# EasyEDA Pro project FromADActiveMarkerDeck.eprj

# Board ActiveMarkerDeck
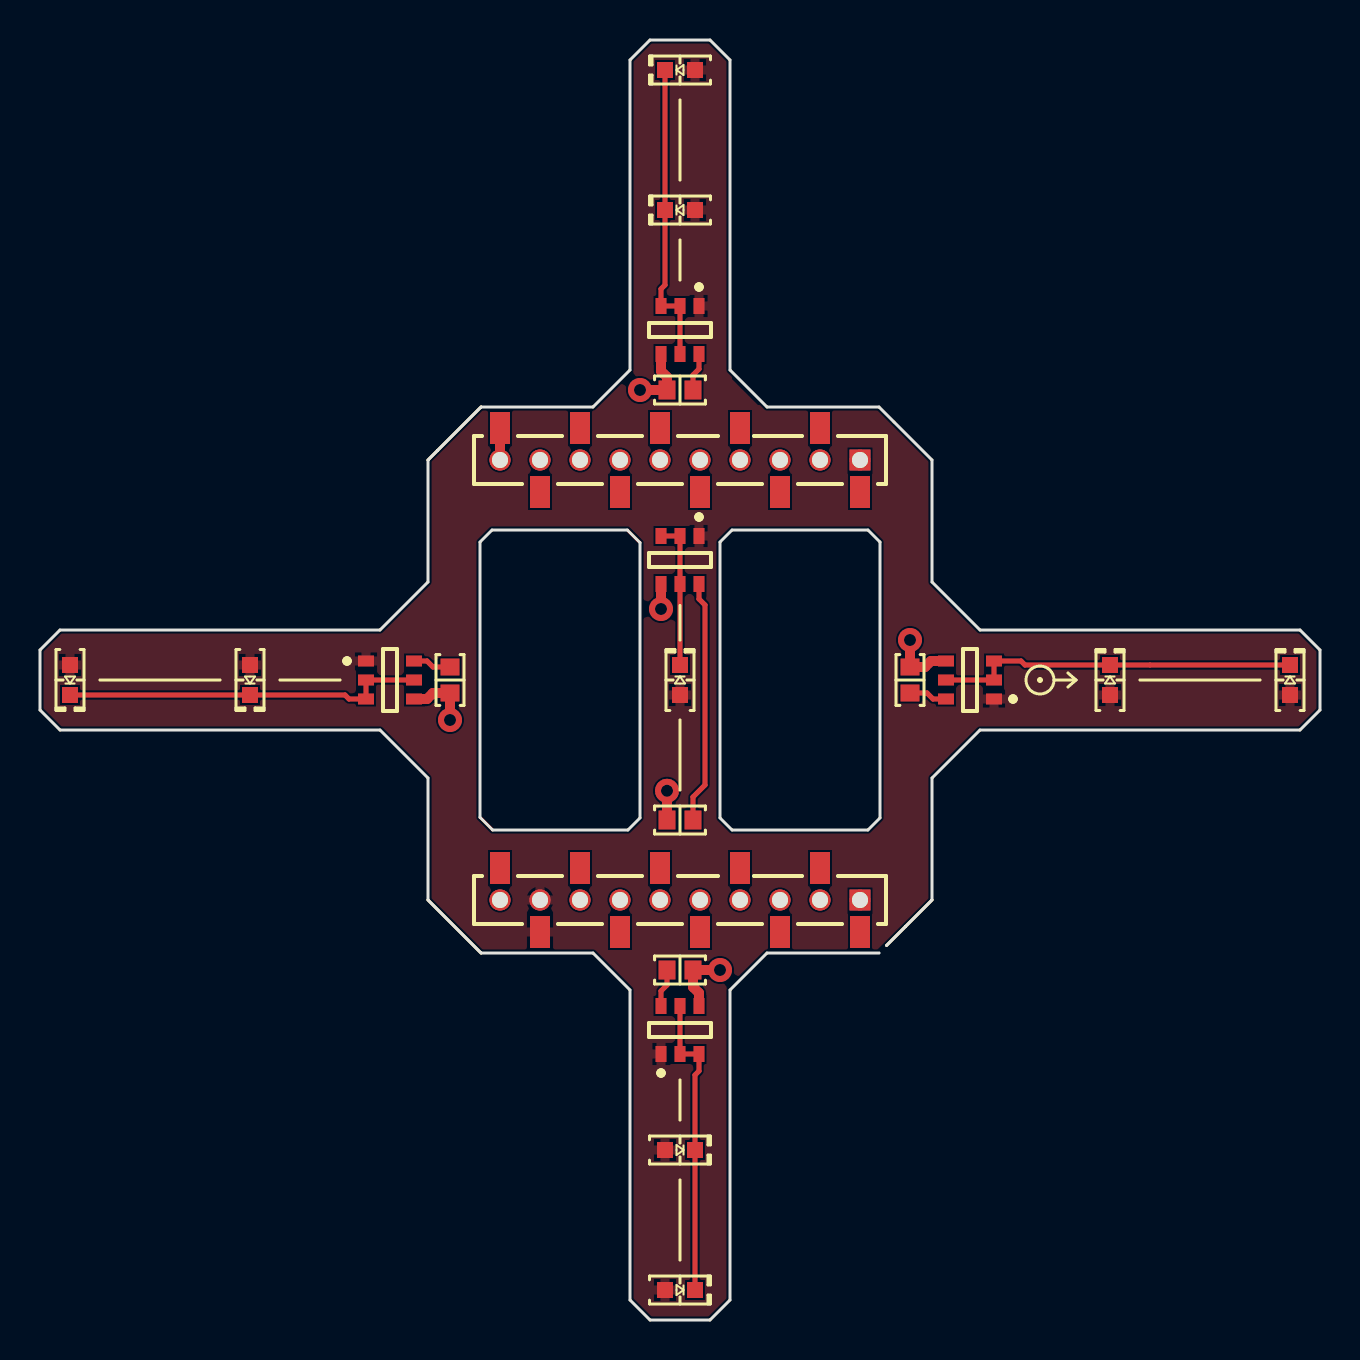
[diagram p0: board, top side]
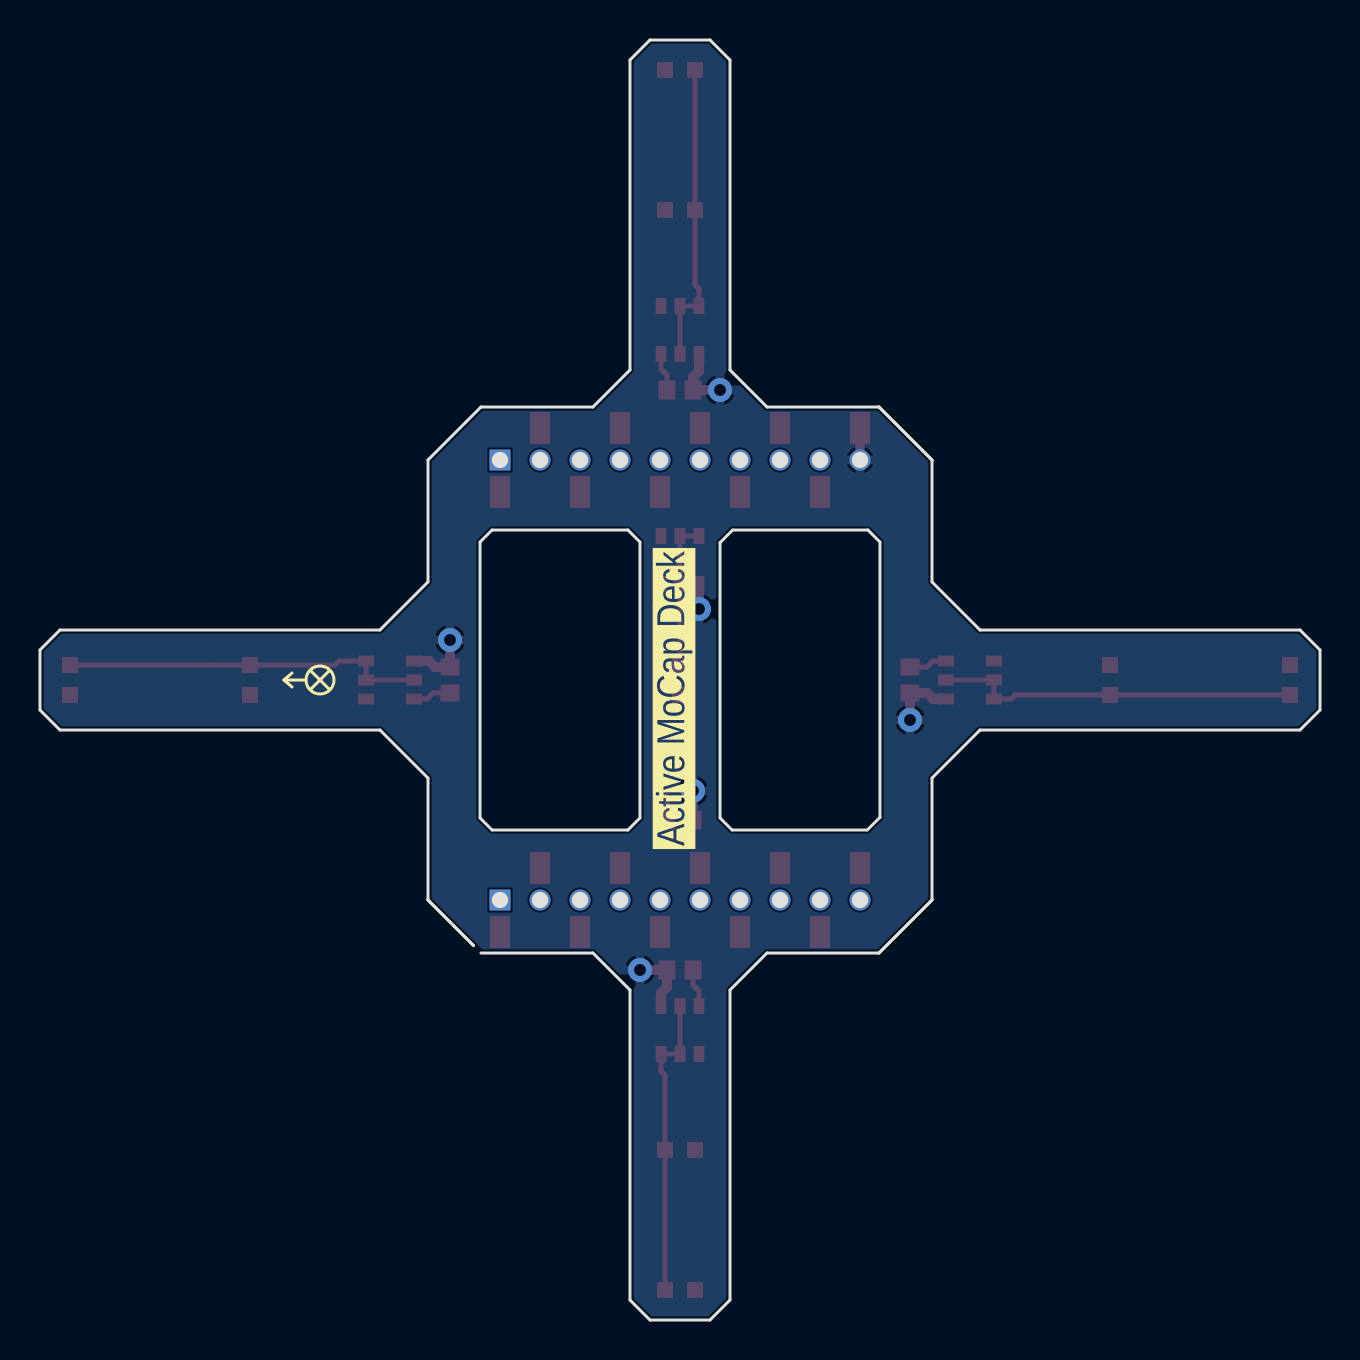
[diagram p1: board, bottom side, seen from below]

Outline 64 x 64 mm; copper layers: Top Layer, Bottom Layer. Coordinates in mm from the lower left corner of the outline.
Outline path: 19.4,43 22.05,45.65 ; 19.4,43 22.05,45.65 ; 19.4,43 19.4,36.9 17,34.5 1,34.5 0,33.5 0,30.5 1,29.5 17,29.5 19.4,27.1 19.4,21 ; 19.4,21 22.05,18.35 ; 19.4,21 22.05,18.35 ; 22.05,45.65 27.65,45.65 29.5,47.5 29.5,63 30.5,64 33.5,64 34.5,63 34.5,47.5 36.35,45.65 41.95,45.65 44.6,43 44.6,36.9 47,34.5 63,34.5 64,33.5 64,30.5 63,29.5 47,29.5 44.6,27.1 44.6,21 ; 22.05,18.35 27.65,18.35 29.5,16.5 29.5,1 30.5,0 33.5,0 34.5,1 34.5,16.5 36.35,18.35 41.95,18.35 ; 44.6,21 42.32,18.72 44.6,21 ; 22,38.9 22.6,39.5 29.37,39.5 30,38.87 30,25.1 29.4,24.5 22.63,24.5 22,25.13 22,38.9 ; 34,38.9 34,25.1 34.6,24.5 41.4,24.5 42,25.1 42,38.9 41.4,39.5 34.6,39.5 34,38.9
Stack: Top Layer 0.0356mm / Dielectric 1 0.32mm FR-4 er 4.8 / Bottom Layer 0.0356mm

## Design rules (mm)
spacing Clearance (default): track to track 0.2, other pairs 0.2 to 0.2
spacing Clearence 0.1524_NetClass: track to track 0.2, other pairs 0.2 to 0.2
track width Width (default): min 0.254, default 0.254, max 0.5
differential pair DiffPairsRouting (default): width min 0.381, default 0.381, max 0.381; gap min 0.254, default 0.254
via RoutingVias (default): diameter min 1.2, default 1.2, max 1.2; hole min 0.6, default 0.6, max 0.6

## Placement (name value [footprint] x y rotation side)
D1  850nm  [LED 0603_1608 RED]  32 32 90 top
D2  850nm  [LED 0603_1608 RED]  32 62.5 180 top
D3  850nm  [LED 0603_1608 RED]  62.5 32 90 top
D4  850nm  [LED 0603_1608 RED]  32 1.5 0 top
D5  850nm  [LED 0603_1608 RED]  1.5 32 270 top
D6  850nm  [LED 0603_1608 RED]  32 55.5 180 top
D7  850nm  [LED 0603_1608 RED]  53.5 32 90 top
D8  850nm  [LED 0603_1608 RED]  32 8.5 0 top
D9  850nm  [LED 0603_1608 RED]  10.5 32 270 top
EXP_ORIENTATION  VAL**  [EXP_ORIENTATION]  50 32 0 top
P1  CF_EXP_LEFT  [BF090-10-X-B2]  32 43 180 top
P2  CF_EXP_RIGHT  [BF090-10-X-B2]  32 21 180 top
R1  20 Ohms  [RES 0603_1608]  32 25 180 top
R2  20 Ohms  [RES 0603_1608]  32 46.5 180 top
R3  20 Ohms  [RES 0603_1608]  43.5 32 90 top
R4  20 Ohms  [RES 0603_1608]  32 17.5 0 top
R5  20 Ohms  [RES 0603_1608]  20.5 32 270 top
U1  BCR421UW6Q-7  [FP-SOT26_SC74R-MFG]  32 38 270 top
U2  BCR421UW6Q-7  [FP-SOT26_SC74R-MFG]  32 49.5 270 top
U3  BCR421UW6Q-7  [FP-SOT26_SC74R-MFG]  46.5 32 180 top
U4  BCR421UW6Q-7  [FP-SOT26_SC74R-MFG]  32 14.5 90 top
U5  BCR421UW6Q-7  [FP-SOT26_SC74R-MFG]  17.5 32 0 top

## Footprints (pads in the part's own frame, mm; a bottom-side part is the same pattern mirrored in y, then rotated)
BF090-10-X-B2
  rect 1x1.6 smd: 1(-9,1.6) 2(-7,-1.6) 3(-5,1.6) 4(-3,-1.6) 5(-1,1.6) 6(1,-1.6) 7(3,1.6) 8(5,-1.6) 9(7,1.6) 10(9,-1.6)
  round 1.05 smd: 1(-9,0) 2(-7,0) 3(-5,0) 4(-3,0) 5(-1,0) 6(1,0) 7(3,0) 8(5,0) 9(7,0) 10(9,0)
  rect 1.05x1.05 hole 0.8: 1(-9,0)
  round 1.05 hole 0.8: 2(-7,0) 3(-5,0) 4(-3,0) 5(-1,0) 6(1,0) 7(3,0) 8(5,0) 9(7,0) 10(9,0)
FP-SOT26_SC74R-MFG
  rect 0.8x0.55 smd: 1(-1.2,0.95) 2(-1.2,0) 3(-1.2,-0.95) 4(1.2,-0.95) 5(1.2,0) 6(1.2,0.95)
LED 0603_1608 RED
  rect 0.8x0.8 smd: 1(-0.75,0) 2(0.75,0)
RES 0603_1608
  rect 0.85x0.95 smd: 1(-0.65,0) 2(0.65,0)

## Nets
GND: P1.10 R1.2 R2.2 R3.2 R4.2 R5.2 U1.4 U2.4 U3.4 U4.4 U5.4
NETD1_2: D1.2 U1.2 U1.3 U1.5
NETD2_2: D2.2 D6.2 U2.2 U2.3 U2.5
NETD3_2: D3.2 D7.2 U3.2 U3.3 U3.5
NETD4_2: D4.2 D8.2 U4.2 U4.3 U4.5
NETD5_2: D5.2 D9.2 U5.2 U5.3 U5.5
NETR1_1: R1.1 U1.6
NETR2_1: R2.1 U2.6
NETR3_1: R3.1 U3.6
NETR4_1: R4.1 U4.6
NETR5_1: R5.1 U5.6
VCOM: D1.1 D2.1 D3.1 D4.1 D5.1 D6.1 D7.1 D8.1 D9.1 P2.9 U1.1 U2.1 U3.1 U4.1 U5.1

Pads without a net: P1 1 2 3 4 5 6 7 8 9; P2 1 2 3 4 5 6 7 8 10

## Via types
v1: diameter 1.2, hole 0.6, Top Layer to Bottom Layer, 6 vias

## Routing (per net, layer and track width the routed paths; a pad name or vN(x,y) marks a point on that pad's centre or on a via; arc(x,y) is an arc through that point)
GND: length 17.4
  Top Layer w0.5: v1(30,46.5) R2.2 31.35,47.15 31.05,47.45 U2.4 ; U3.4 44.55,32.95 44.25,32.65 R3.2 v1(43.5,34) ; v1(31.05,35.55) U1.4 ; R1.2 v1(31.35,26.46) ; P1.10 P1.10 ; U5.4 19.35,31.05 19.65,31.35 R5.2 v1(20.5,30) ; v1(34,17.5) R4.2 32.65,16.65 32.95,16.35 U4.4
NETD1_2: length 7.4
  Top Layer w0.254: U1.3 U1.2 U1.5 D1.2
NETD2_2: length 15.2
  Top Layer w0.254: U2.5 U2.2 U2.3 31.05,51.55 31.25,51.75 D2.2
NETD3_2: length 18.2
  Top Layer w0.254: U3.5 U3.2 U3.3 49.05,32.95 49.25,32.75 D3.2
NETD4_2: length 15.2
  Top Layer w0.254: D4.2 32.75,12.25 32.95,12.45 U4.3 U4.2 U4.5
NETD5_2: length 18.2
  Top Layer w0.254: D5.2 D9.2 15.25,31.25 15.45,31.05 U5.3 U5.2 U5.5
NETR1_1: length 12.2
  Top Layer w0.254: U1.6 32.95,36.05 33.25,35.75 33.25,26.75 32.65,26.15 R1.1
NETR2_1: length 1.9
  Top Layer w0.254: U2.6 32.95,47.55 32.65,47.25 R2.1
NETR3_1: length 1.9
  Top Layer w0.254: U3.6 44.65,31.05 44.35,31.35 R3.1
NETR4_1: length 1.9
  Top Layer w0.254: R4.1 31.35,16.75 31.05,16.45 U4.6
NETR5_1: length 1.9
  Top Layer w0.254: U5.6 19.35,32.95 19.65,32.65 R5.1

## Copper pours and planes (outline as drawn; the poured copper is in the pictures)
GND on Bottom Layer: 30.5,64 29.5,63 29.5,47.5 27.65,45.65 22.05,45.65 19.4,43 19.4,36.9 17,34.5 1,34.5 0,33.5 0,30.5 1,29.5 17,29.5 19.4,27.1 19.4,21 22.05,18.35 27.65,18.35 29.5,16.5 29.5,1 30.5,0 33.5,0 34.5,1 34.5,16.5 36.35,18.35 41.95,18.35 44.6,21 44.6,27.1 47,29.5 63,29.5 64,30.5 64,33.5 63,34.5 47,34.5 44.6,36.9 44.6,43 41.95,45.65 36.35,45.65 34.5,47.5 34.5,63 33.5,64
VCOM on Top Layer: 30.5,64 29.5,63 29.5,47.5 27.65,45.65 22.05,45.65 19.4,43 19.4,36.9 17,34.5 1,34.5 0,33.5 0,30.5 1,29.5 17,29.5 19.4,27.1 19.4,21 22.05,18.35 27.65,18.35 29.5,16.5 29.5,1 30.5,0 33.5,0 34.5,1 34.5,16.5 36.35,18.35 41.95,18.35 44.6,21 44.6,27.1 47,29.5 63,29.5 64,30.5 64,33.5 63,34.5 47,34.5 44.6,36.9 44.6,43 41.95,45.65 35.85,45.65 34.5,47 34.5,63 33.5,64

## Text on the board
Bottom Silkscreen Layer: Active MoCap Deck
Pin Floating Layer: M1 | M3 | M4 | M2 | ANT | Crazyflie 2.0 | BAT | BTN | Bitcraze | uUSB | SWD
